# Altium schematic sheet Periph.SchDoc
size A3; DocumentNumber: 3; SheetNumber: 3; SheetTotal: 7
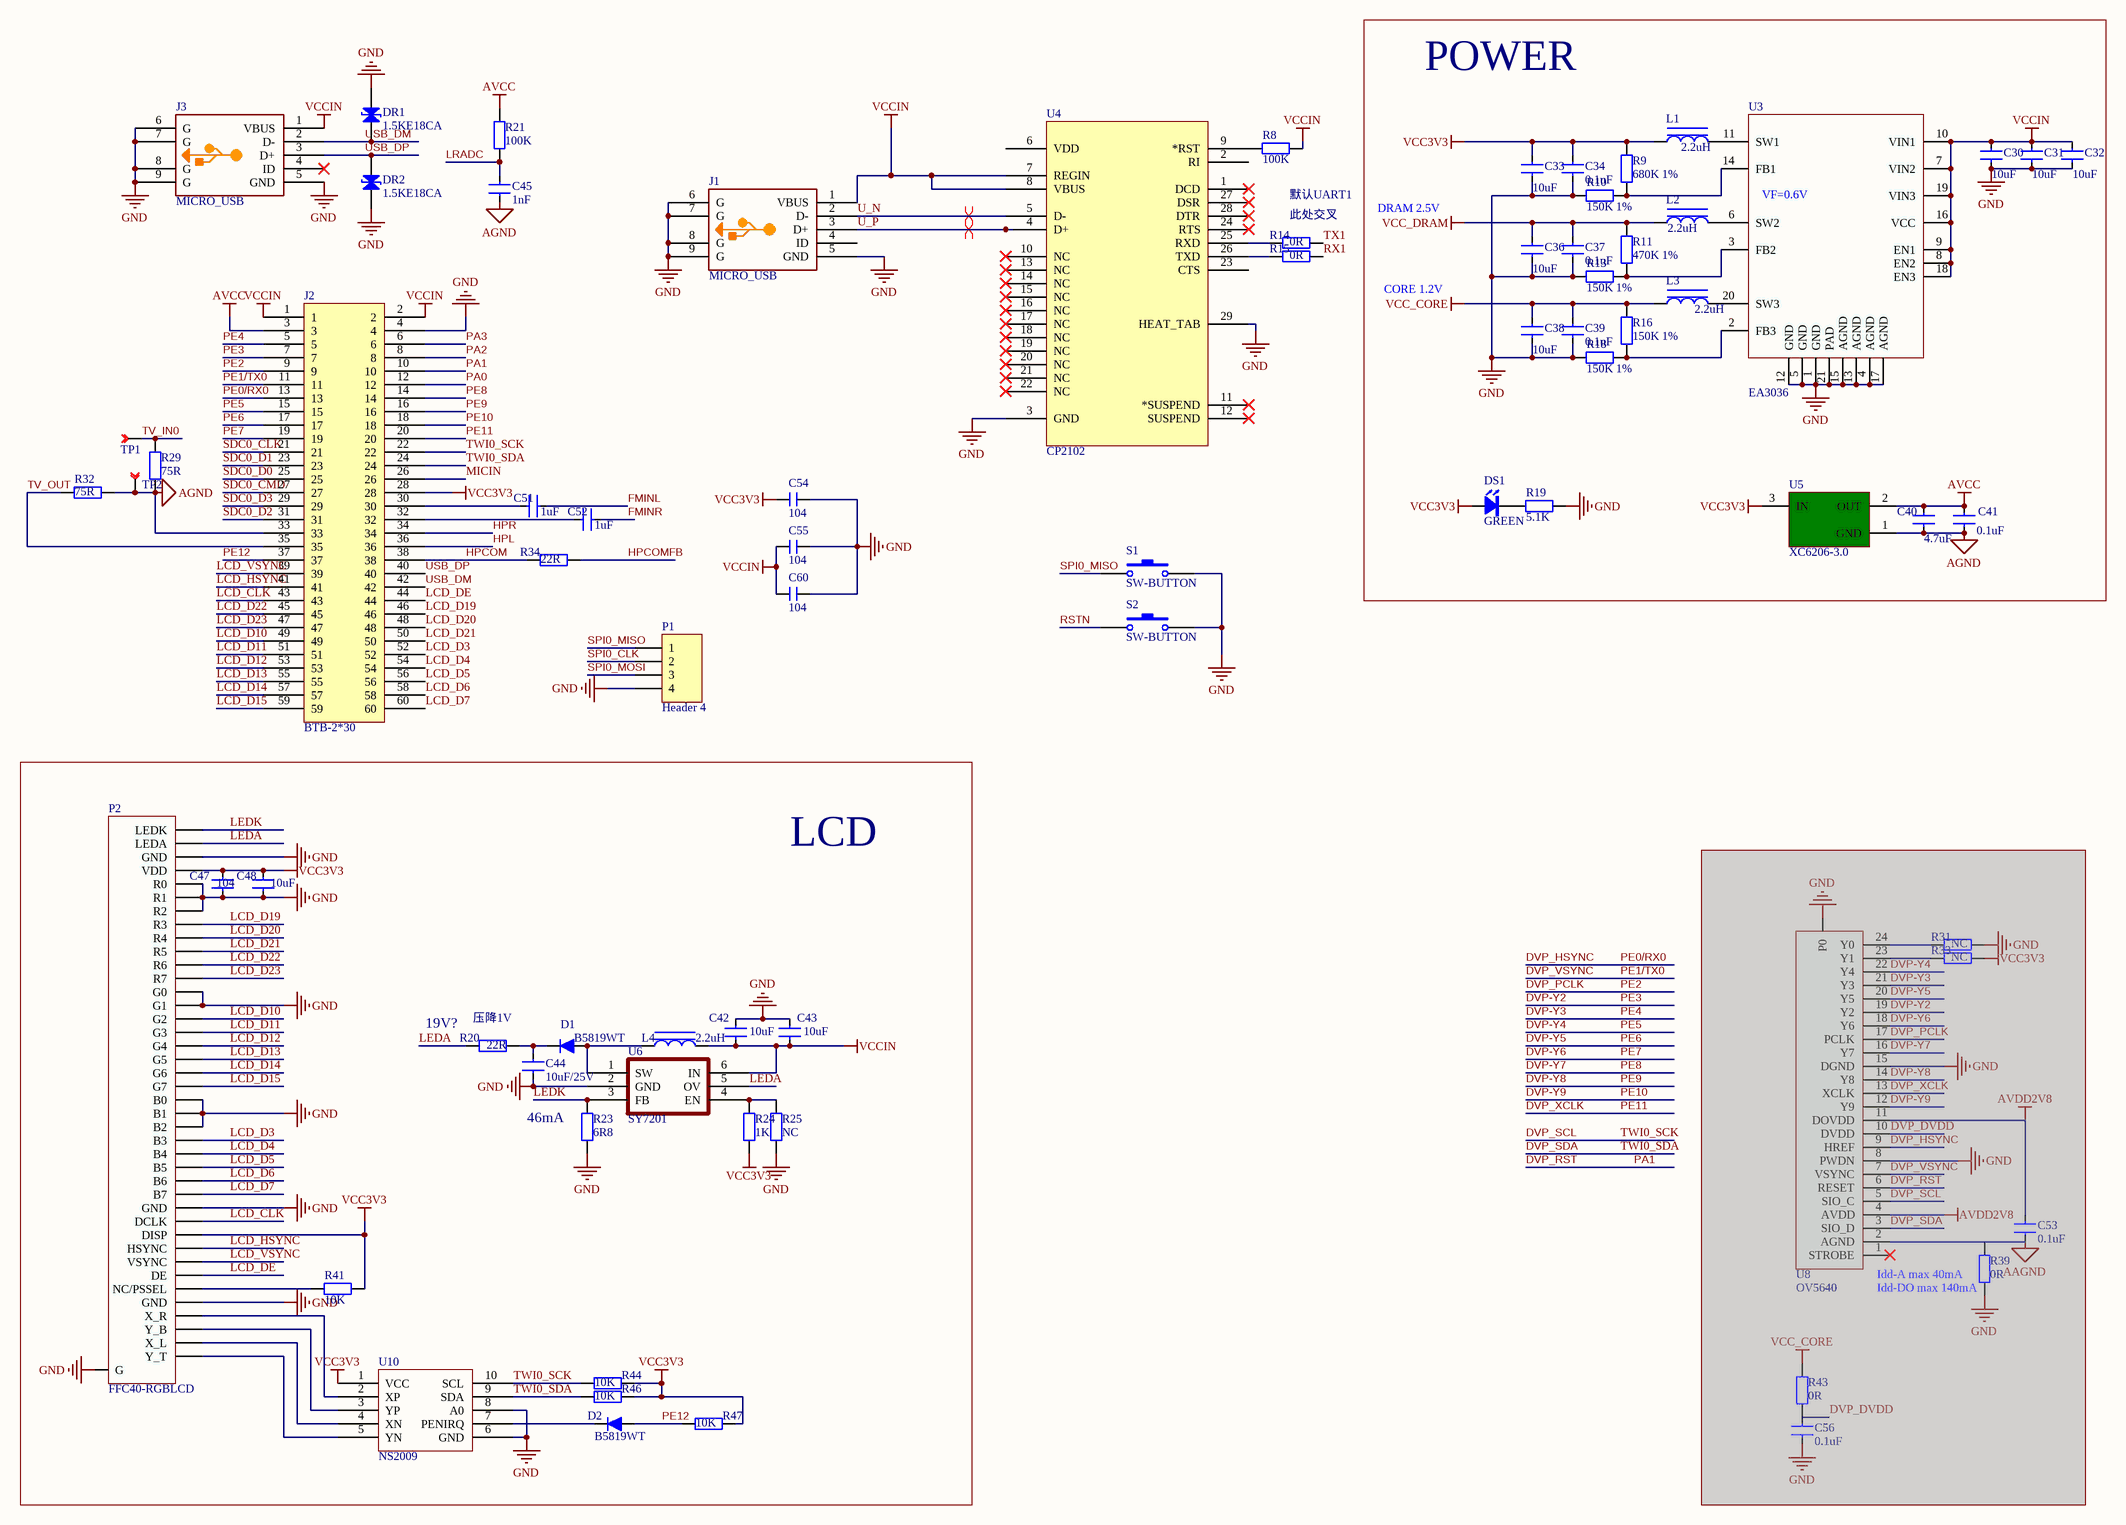
[diagram p0: Periph.SchDoc]

## Parts
C30  10uF  [C0402]
C31  10uF  [C0402]
C32  10uF  [C0402]
C33  10uF  [C0402]
C34  0.1uF  [C0402]
C36  10uF  [C0402]
C37  0.1uF  [C0402]
C38  10uF  [C0402]
C39  0.1uF  [C0402]
C40  4.7uF  [C0402]
C41  0.1uF  [C0402]
C42  10uF  [C0402]
C43  10uF  [C0402]
C44  10uF/25V  [C0402]
C45  1nF  [C0402]
C47  104  [C0402]
C48  10uF  [C0402]
C51  1uF  [C0402]
C52  1uF  [C0402]
C53  0.1uF  [C0402]  (masked out: inside a compile mask, not in the netlist)
C54  104  [C 1206_L]
C55  104  [C 1206_L]
C56  0.1uF  [C0402]  (masked out: inside a compile mask, not in the netlist)
C60  104  [C 1206_L]
D1  B5819WT  [SOD523]
D2  B5819WT  [SOD523]
DR1  1.5KE18CA  [C 0805_L]
DR2  1.5KE18CA  [C 0805_L]
DS1  GREEN  [LED0402]
J1  MICRO_USB  [MICROUSB-youxin]
J2  BTB-2*30  [CONN-SMD_BA41-60AT-1-ZHB]
J3  MICRO_USB  [MICROUSB-youxin]
L1  2.2uH  [VLS2016]
L2  2.2uH  [VLS2016]
L3  2.2uH  [VLS2016]
L4  2.2uH  [VLS3012E]
P1  Header 4  [HDR1X4]
P2  FFC40-RGBLCD  [FFC/SM0.5-1H40]
R8  100K  [R 0402_M]
R9  680K 1%  [R0402]
R10  150K 1%  [R0402]
R11  470K 1%  [R0402]
R13  150K 1%  [R0402]
R14  0R  [R0402]
R15  0R  [R0402]
R16  150K 1%  [R0402]
R18  150K 1%  [R0402]
R19  5.1K  [R0402]
R20  22R  [R0603]
R21  100K  [R0402]
R23  6R8  [R0402]
R24  1K  [R0402]
R25  NC  [R0402]
R29  75R  [R0402]
R31  NC  [R0402]  (masked out: inside a compile mask, not in the netlist)
R32  75R  [R0402]
R33  NC  [R0402]  (masked out: inside a compile mask, not in the netlist)
R34  22R  [R0402]
R39  0R  [R0402]  (masked out: inside a compile mask, not in the netlist)
R41  10K  [R0402]
R43  0R  [R0402]  (masked out: inside a compile mask, not in the netlist)
R44  10K  [R0402]
R46  10K  [R0402]
R47  10K  [R0402]
S1  SW-BUTTON  [MINIBUTTON]
S2  SW-BUTTON  [MINIBUTTON]
TP1  TEST POINT  [TEST-POINT]  (value not drawn)
TP2  TEST POINT  [TEST-POINT]  (value not drawn)
U3  EA3036  [QFN40P300X300X80_HS-21N]
U4  CP2102  [QFN28 5x5_N]
U5  XC6206-3.0  [SOT23]
U6  SY7201  [SOT23-6]
U8  OV5640  [FFC/SM0.5-1H24 - OV2640]  (masked out: inside a compile mask, not in the netlist)
U10  NS2009  [TSSOP10]

## Blocks framed on the sheet
POWER: C30-C34 C36-C41 DS1 L1-L3 R9-R11 R13 R16 R18 R19 U3 U5
LCD: C42-C44 C47 C48 D1 D2 L4 P2 R20 R23-R25 R41 R44 R46 R47 U6 U10

## Nets
AGND: C40.1 C41.1 C45.1 J2.33 R29.2 R32.2 TP2.1 U5.1(GND)
AVCC: C40.2 C41.2 J2.3 R21.2 U5.2(OUT)
GND: C30.2 C31.2 C32.2 C33.2 C34.1 C36.2 C37.1 C38.2 C39.1 C42.2 C43.1 C44.1 C47.2 C48.1 C54.2 C55.2 C60.2 DR1.1(A) DR2.2(K) J1.5(GND) J1.6(G) J1.7(G) J1.8(G) J1.9(G) J2.4 J3.5(GND) J3.6(G) J3.7(G) J3.8(G) J3.9(G) P1.4 P2.3(GND) P2.5(R0) P2.6(R1) P2.7(R2) P2.13(G0) P2.14(G1) P2.21(B0) P2.22(B1) P2.23(B2) P2.29(GND) P2.36(GND) P2.G R10.2 R13.2 R18.2 R19.2 R23.1 R25.2 S1.2 S2.2 U3.1(GND) U3.4(AGND) U3.5(GND) U3.12(GND) U3.13(AGND) U3.15(AGND) U3.17(AGND) U3.21(PAD) U4.3(GND) U4.29(HEAT_TAB) U6.2(GND) U10.6(GND) U10.8(A0)
VCC3V3: C33.1 C34.2 C47.1 C48.2 C54.1 DS1.A J2.28 L1.2 P2.4(VDD) P2.31(DISP) R9.1 R24.1 R41.1 R44.2 R46.2 R47.2 U5.3(IN) U10.1(VCC)
VCC_CORE: C38.1 C39.2 L3.2 R16.1
VCC_DRAM: C36.1 C37.2 L2.2 R11.1
VCCIN: C30.1 C31.1 C32.1 C42.1 C43.2 C55.1 C60.1 J1.1(VBUS) J2.1 J2.2 J3.1(VBUS) L4.1 R8.1 U3.7(VIN2) U3.8(EN2) U3.9(EN1) U3.10(VIN1) U3.16(VCC) U3.18(EN3) U3.19(VIN3) U4.7(REGIN) U4.8(VBUS) U6.6(IN)
DVP-Y2: J2.7  [also labelled PE3]
DVP-Y3: J2.5  [also labelled PE4]
DVP-Y4: J2.15  [also labelled PE5]
DVP-Y5: J2.17  [also labelled PE6]
DVP-Y6: J2.19  [also labelled PE7]
DVP-Y7: J2.14  [also labelled PE8]
DVP-Y8: J2.16  [also labelled PE9]
DVP-Y9: J2.18  [also labelled PE10]
DVP_HSYNC: J2.13  [also labelled PE0/RX0]
DVP_PCLK: J2.9  [also labelled PE2]
DVP_RST: J2.10  [also labelled PA1]
DVP_SCL: J2.22 R44.1 U10.10(SCL)  [also labelled TWI0_SCK]
DVP_SDA: J2.24 R46.1 U10.9(SDA)  [also labelled TWI0_SDA]
DVP_VSYNC: J2.11  [also labelled PE1/TX0]
DVP_XCLK: J2.20  [also labelled PE11]
FMINL: C51.2
FMINR: C52.2
HPCOM: J2.38 R34.1
HPCOMFB: R34.2
HPL: J2.36
HPR: J2.34
LCD_CLK: J2.43 P2.30(DCLK)
LCD_D3: J2.52 P2.24(B3)
LCD_D4: J2.54 P2.25(B4)
LCD_D5: J2.56 P2.26(B5)
LCD_D6: J2.58 P2.27(B6)
LCD_D7: J2.60 P2.28(B7)
LCD_D10: J2.49 P2.15(G2)
LCD_D11: J2.51 P2.16(G3)
LCD_D12: J2.53 P2.17(G4)
LCD_D13: J2.55 P2.18(G5)
LCD_D14: J2.57 P2.19(G6)
LCD_D15: J2.59 P2.20(G7)
LCD_D19: J2.46 P2.8(R3)
LCD_D20: J2.48 P2.9(R4)
LCD_D21: J2.50 P2.10(R5)
LCD_D22: J2.45 P2.11(R6)
LCD_D23: J2.47 P2.12(R7)
LCD_DE: J2.44 P2.34(DE)
LCD_HSYNC: J2.41 P2.32(HSYNC)
LCD_VSYNC: J2.39 P2.33(VSYNC)
LEDA: P2.2(LEDA) R20.2 U6.5(OV)
LEDK: P2.1(LEDK) R23.2 U6.3(FB)
LRADC: C45.2 R21.1
MICIN: J2.26
PA0: J2.12
PA2: J2.8
PA3: J2.6
PE12: D2.A J2.37 R47.1
RSTN: S2.1
RX1: R15.1
SDC0_CLK: J2.21
SDC0_CMD: J2.27
SDC0_D0: J2.25
SDC0_D1: J2.23
SDC0_D2: J2.31
SDC0_D3: J2.29
SPI0_CLK: P1.2
SPI0_MISO: P1.1 S1.1
SPI0_MOSI: P1.3
TV_IN0: R29.1 TP1.1
TV_OUT: J2.35 R32.1
TX1: R14.1
U_N: J1.2(D-) U4.5(D-)
U_P: J1.3(D+) U4.4(D+)
USB_DM: DR1.2(K) J2.42 J3.2(D-)
USB_DP: DR2.1(A) J2.40 J3.3(D+)
NetC44_2: C44.2 D1.K R20.1
NetC51_1: C51.1 J2.30
NetC52_1: C52.1 J2.32
NetD1_A: D1.A L4.2 U6.1(SW)
NetD2_K: D2.K U10.7(PENIRQ)
NetDS1_K: DS1.K R19.1
NetL1_1: L1.1 U3.11(SW1)
NetL2_1: L2.1 U3.6(SW2)
NetL3_1: L3.1 U3.20(SW3)
NetP2_35: P2.35(NC/PSSEL) R41.2
NetP2_37: P2.37(X_R) U10.2(XP)
NetP2_38: P2.38(Y_B) U10.3(YP)
NetP2_39: P2.39(X_L) U10.4(XN)
NetP2_40: P2.40(Y_T) U10.5(YN)
NetR8_2: R8.2 U4.9(*RST)
NetR9_2: R9.2 R10.1 U3.14(FB1)
NetR11_2: R11.2 R13.1 U3.3(FB2)
NetR14_2: R14.2 U4.25(RXD)
NetR15_2: R15.2 U4.26(TXD)
NetR16_2: R16.2 R18.1 U3.2(FB3)
NetR24_2: R24.2 R25.1 U6.4(EN)

Not connected (* = marked no-connect by the designer): J1 4(ID); J3 4(ID)*; U4 1(DCD)* 2(RI) 6(VDD) 10(NC)* 11(*SUSPEND)* 12(SUSPEND)* 13(NC)* 14(NC)* 15(NC)* 16(NC)* 17(NC)* 18(NC)* 19(NC)* 20(NC)* 21(NC)* 22(NC)* 23(CTS) 24(RTS)* 27(DSR)* 28(DTR)*

## Layout directives
differential pair: U_N, U_P

## Notes on the sheet
- 默认UART1
- (near U3) VF=0.6V
- 此处交叉
- DRAM 2.5V
- CORE 1.2V
- (near R20) 19V?
- (near R20) 压降1V
- 46mA
- Idd-A max 40mA
- (near R39) Idd-DO max 140mA

## Library data of the parts
C30-C34 C36-C45 C47 C48 C51-C53 C56 = CAP: 普通小电容
C54 C55 C60 = C: 无极性贴片电容; 版权归属: 源创客; 材质: X7R; BOM名称: 无极性贴片电容; 学习资源: www.ooocke.com
D1 D2 = Diode: 普通二极管
DR1 DR2 = DR: 瞬态电压抑制二极管; 版权归属: 源创客; BOM名称: 瞬态电压抑制二极管; 学习资源: www.ooocke.com
DS1 = LED
J2 = BTB-2*30PIN: 连接器
L1-L4 = L: 普通电感
P1 = Header 4: Header, 4-Pin; LatestRevisionDate: 17-Jul-2002; LatestRevisionNote: Re-released for DXP Platform.; Publisher: Altium Limited
R8-R11 R13-R16 R18 R20 R21 R23-R25 R29 R31-R34 R39 R41 R43 R44 R46 R47 = RES: 普通电阻
R19 = RES: 普通电阻1%精度
TP1 TP2 = TP: Description
U4 = CP2102: USB转TTL; PART DESC: SINGLE-CHIP USB TO UART BRIDGE, QFN28, RoHS.; MFG #1: SILICON LABS; PART NUMBER: CP2102; Value: Value; RefDes: RefDes; Type: DEV
U5 = XC6206
U6 = PT4101
U8 = OV5640: Header, 24-Pin; LatestRevisionDate: 17-Jul-2002; LatestRevisionNote: Re-released for DXP Platform.; Publisher: Altium Limited
P2 = FFC40-RGBLCD: LatestRevisionDate: 17-Jul-2002; LatestRevisionNote: Re-released for DXP Platform.; Publisher: Altium Limited